# EAGLE design SensorModuleConector (EAGLE 7.6.0)
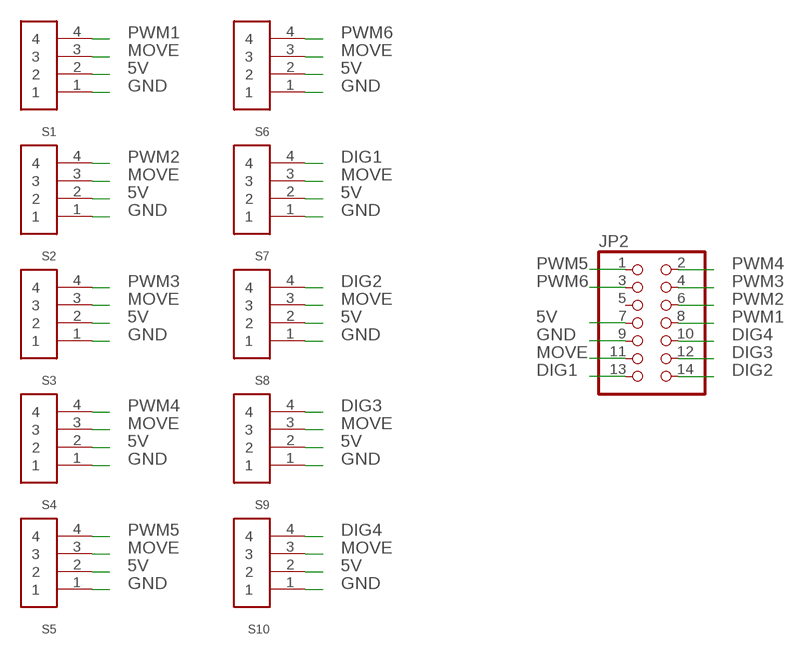
[diagram p0: schematic, sheet 1]

## Parts
JP2  PINHD-2X7  [2X07]
S1  CP150_1X4  [CP150_1X4]
S2  CP150_1X4  [CP150_1X4]
S3  CP150_1X4  [CP150_1X4]
S4  CP150_1X4  [CP150_1X4]
S5  CP150_1X4  [CP150_1X4]
S6  CP150_1X4  [CP150_1X4]
S7  CP150_1X4  [CP150_1X4]
S8  CP150_1X4  [CP150_1X4]
S9  CP150_1X4  [CP150_1X4]
S10  CP150_1X4  [CP150_1X4]

## Nets
5V: JP2.7 S1.2 S2.2 S3.2 S4.2 S5.2 S6.2 S7.2 S8.2 S9.2 S10.2
DIG1: JP2.13 S7.4
DIG2: JP2.14 S8.4
DIG3: JP2.12 S9.4
DIG4: JP2.10 S10.4
GND: JP2.9 S1.1 S2.1 S3.1 S4.1 S5.1 S6.1 S7.1 S8.1 S9.1 S10.1
MOVE: JP2.11 S1.3 S2.3 S3.3 S4.3 S5.3 S6.3 S7.3 S8.3 S9.3 S10.3
PWM1: JP2.8 S1.4
PWM2: JP2.6 S2.4
PWM3: JP2.4 S3.4
PWM4: JP2.2 S4.4
PWM5: JP2.1 S5.4
PWM6: JP2.3 S6.4
Unconnected: JP2.5

## Library data of the parts
JP2 = pinhead:PINHD-2X7: PIN HEADER
S1-S10 = cp150:CP150_1X4

## Board
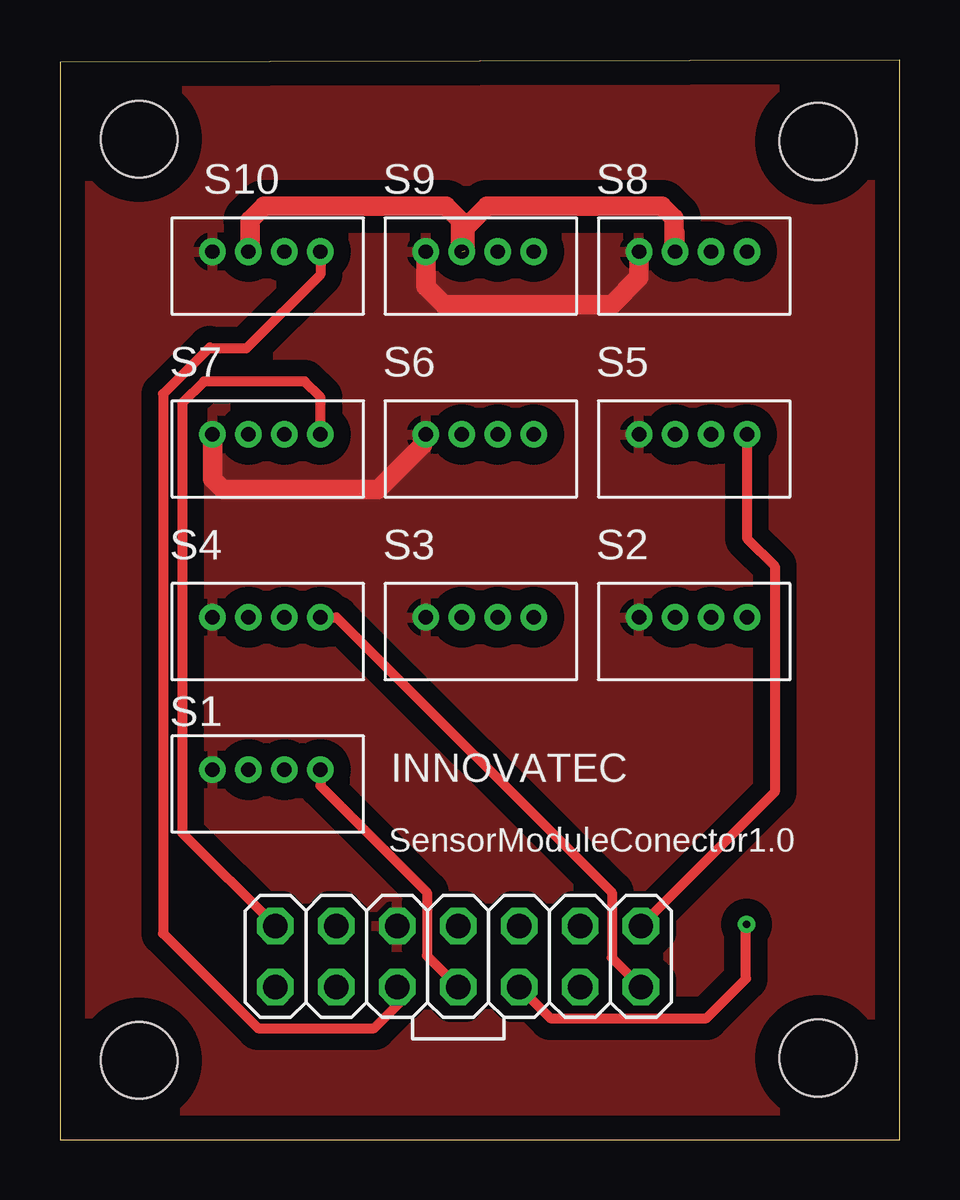
[diagram p1: board, top side]
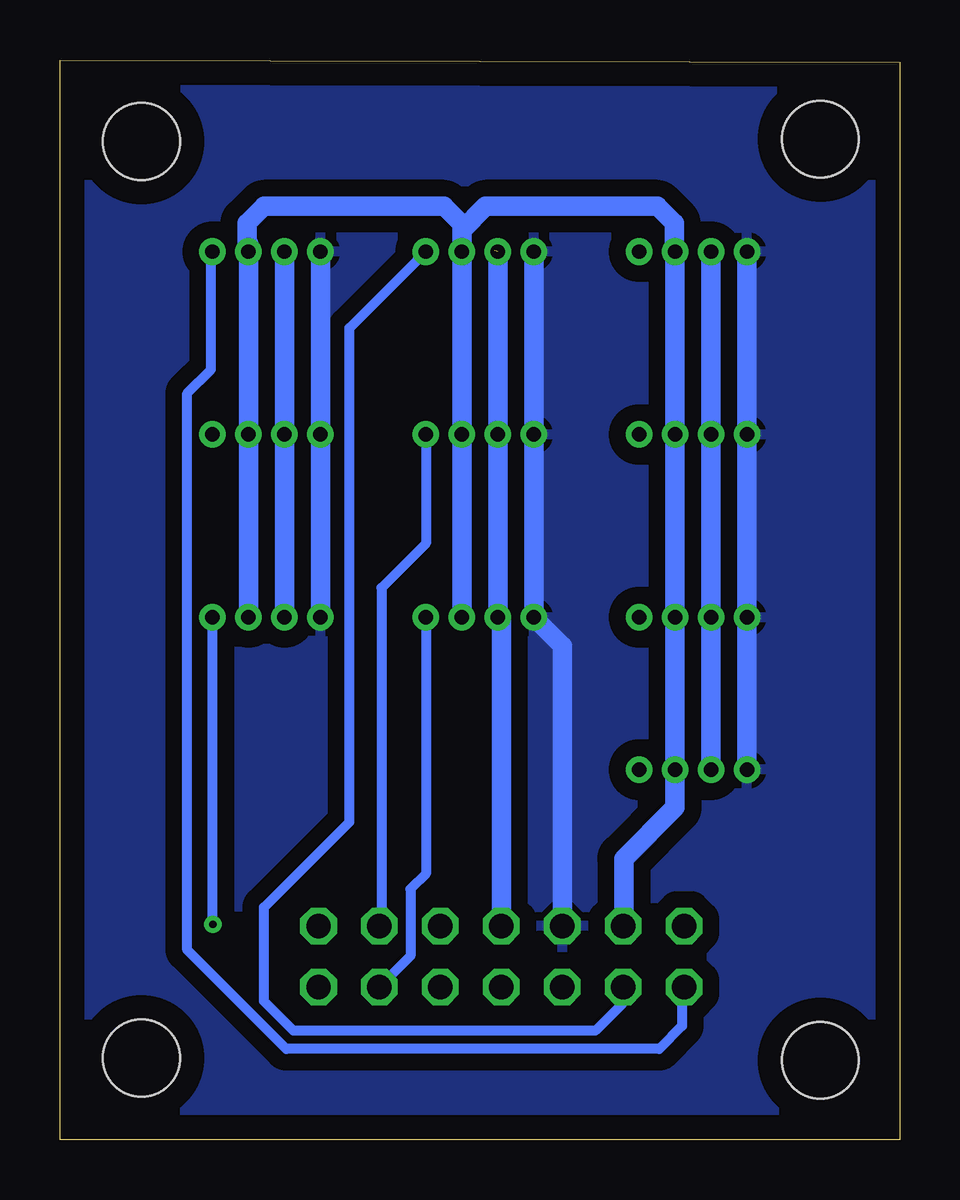
[diagram p2: board, bottom side, seen from below]

Size 35 x 45 mm. Coordinates in mm from the lower left corner, seen from the top.
Outline: 0,0 35,0 35,45 0,44.9 0,0
Copper layers (1*16): Top 0.035mm / dielectric 1.5mm / Bottom 0.035mm
Design rules "default *": minimum track width 16mil, minimum drill 8mil, track to track 12mil, track to pad 12mil, pad to pad 8mil, via to via 12mil, smd to smd 8mil, copper to edge 40mil, drill to drill 8mil, minimum pad ring 10mil, minimum via ring 8mil, stop-mask expansion 4mil, vias tented up to drill 0mil, thermal gap 10mil
Holes 3.2 mm at 3.3,41.7 31.6,41.6 3.3,3.3 31.6,3.4

### Footprints (pad centres in the part's own frame; a part is rotated, then mirrored left to right if it is on the bottom)
2X07 = drill 1.016 octagon: 1 -7.62,-1.27; 2 -7.62,1.27; 3 -5.08,-1.27; 4 -5.08,1.27; 5 -2.54,-1.27; 6 -2.54,1.27; 7 0,-1.27; 8 0,1.27; 9 2.54,-1.27; 10 2.54,1.27; 11 5.08,-1.27; 12 5.08,1.27; 13 7.62,-1.27; 14 7.62,1.27
CP150_1X4 = drill 0.6: 1 -2.2,0; 2 -0.7,0; 3 0.8,0; 4 2.3,0

### Placement (x,y rotation side)
JP2  16.6,7.63 180 top
S1  8.56,15.42 0 top
S2  26.34,21.77 0 top
S3  17.45,21.77 0 top
S4  8.56,21.77 0 top
S5  26.34,29.39 0 top
S6  17.45,29.39 0 top
S7  8.56,29.39 0 top
S8  26.34,37.01 0 top
S9  17.45,37.01 0 top
S10  8.56,37.01 0 top

### Tracks (layer width: path | path; a pad name or v marks a point on that pad's centre or on a via)
5V  (1 unrouted)
  Top 0.406: 8,37.42 8,37.06 S10.2
  Top 0.813: S10.2 7.92,37.07 7.92,38.32 8.5,38.9 16.1,38.9 16.7,38.3 16.7,37.06 S9.2 | 16.89,37.06 16.89,37.99 17.8,38.9 25.1,38.9 25.6,38.4 25.6,37.05 S8.2 25.63,37.8
  Bottom 0.813: S10.2 S7.2 S4.2 S1.2 | S9.2 S6.2 S3.2 16.6,21.62 JP2.7 | S8.2 S5.2 S2.2
DIG1
  Top 0.406: S7.4 10.86,30.94 10.2,31.6 6,31.6 5.1,30.7 5.1,12.78 JP2.13
DIG2
  Bottom 0.406: JP2.14 9.07,6.12 9.07,4.73 10.02,3.78 25.57,3.78 29.69,7.9 29.69,31.11 28.7,32.1 28.7,36.95 S8.4
DIG3
  Bottom 0.406: 20.09,36.7 S9.4 22.94,33.82 22.94,13.24 26.49,9.68 26.49,5.77 25.26,4.54 12.68,4.54 11.56,5.66 11.56,6.12 JP2.12
DIG4
  Top 0.406: JP2.10 14.11,6.31 14.11,5.65 13.1,4.64 8.25,4.64 4.3,8.59 4.3,31.08 6.24,33.02 6.29,32.97 7.77,32.97 10.86,36.06 S10.4
GND
  Top 0.406: 15.11,29.24 S6.1 | 6.58,29.24 S7.1
  Top 0.813: S9.1 15.25,35.55 16,34.8 23,34.8 24.14,35.94 S8.1 | 15.11,29.24 15.11,28.94 13.27,27.1 6.8,27.1 6.36,27.54 S7.1
  Bottom 0.813: S10.1 S7.1 S4.1 S1.1 | S9.1 S6.1 S3.1 14.06,20.58 JP2.9 | S8.1 S5.1 S2.1
  pour Bottom (isolate 0.7): -4.3,45.1 37.3,46.5 37.3,-0.5 -4.1,-1.9
  pour Top (isolate 0.7): -3.6,47.5 38.8,46.6 38.8,-2.4 -3.7,-1.6
MOVE
  Bottom 0.813: S9.3 S6.3 S3.3 18.25,38.15 19,38.9 26.5,38.9 27.2,38.2 27.2,37.07 S8.3 | S2.3 S5.3 S8.3 | S8.3 27.14,37.35 | S9.3 18.25,37.91 17.26,38.9 10.1,38.9 9.39,38.19 9.39,37.04 S10.3 S7.3 S4.3 S1.3 9.36,13.84 11.5,11.7 11.5,8.92 JP2.11 | S9.3 18.25,37.77
PWM1
  Top 0.406: S1.4 10.86,14.74 15.3,10.3 15.3,7.66 JP2.8
PWM2  (via drill 0.3)
  Top 0.406: JP2.6 19.38,6.12 20.45,5.06 26.96,5.06 28.6,6.7 28.6,8.94 v28.63,8.97
  Bottom 0.406: v28.63,8.97 28.63,21.77 S2.4
PWM3
  Bottom 0.406: S3.4 19.75,11.08 20.39,10.44 20.39,7.65 JP2.4
PWM4
  Top 0.406: S4.4 11.53,21.77 23,10.3 23,7.58 JP2.2
PWM5
  Top 0.406: S5.4 28.64,25.06 29.8,23.9 29.8,14.48 JP2.1
PWM6
  Bottom 0.406: S6.4 19.75,24.85 21.6,23 21.6,8.98 JP2.3

### Text on the board
tPlace: INNOVATEC | SensorModuleConector1.0